# EAGLE design optoinout (EAGLE 9.4.0)

## Sheet 1 of 2
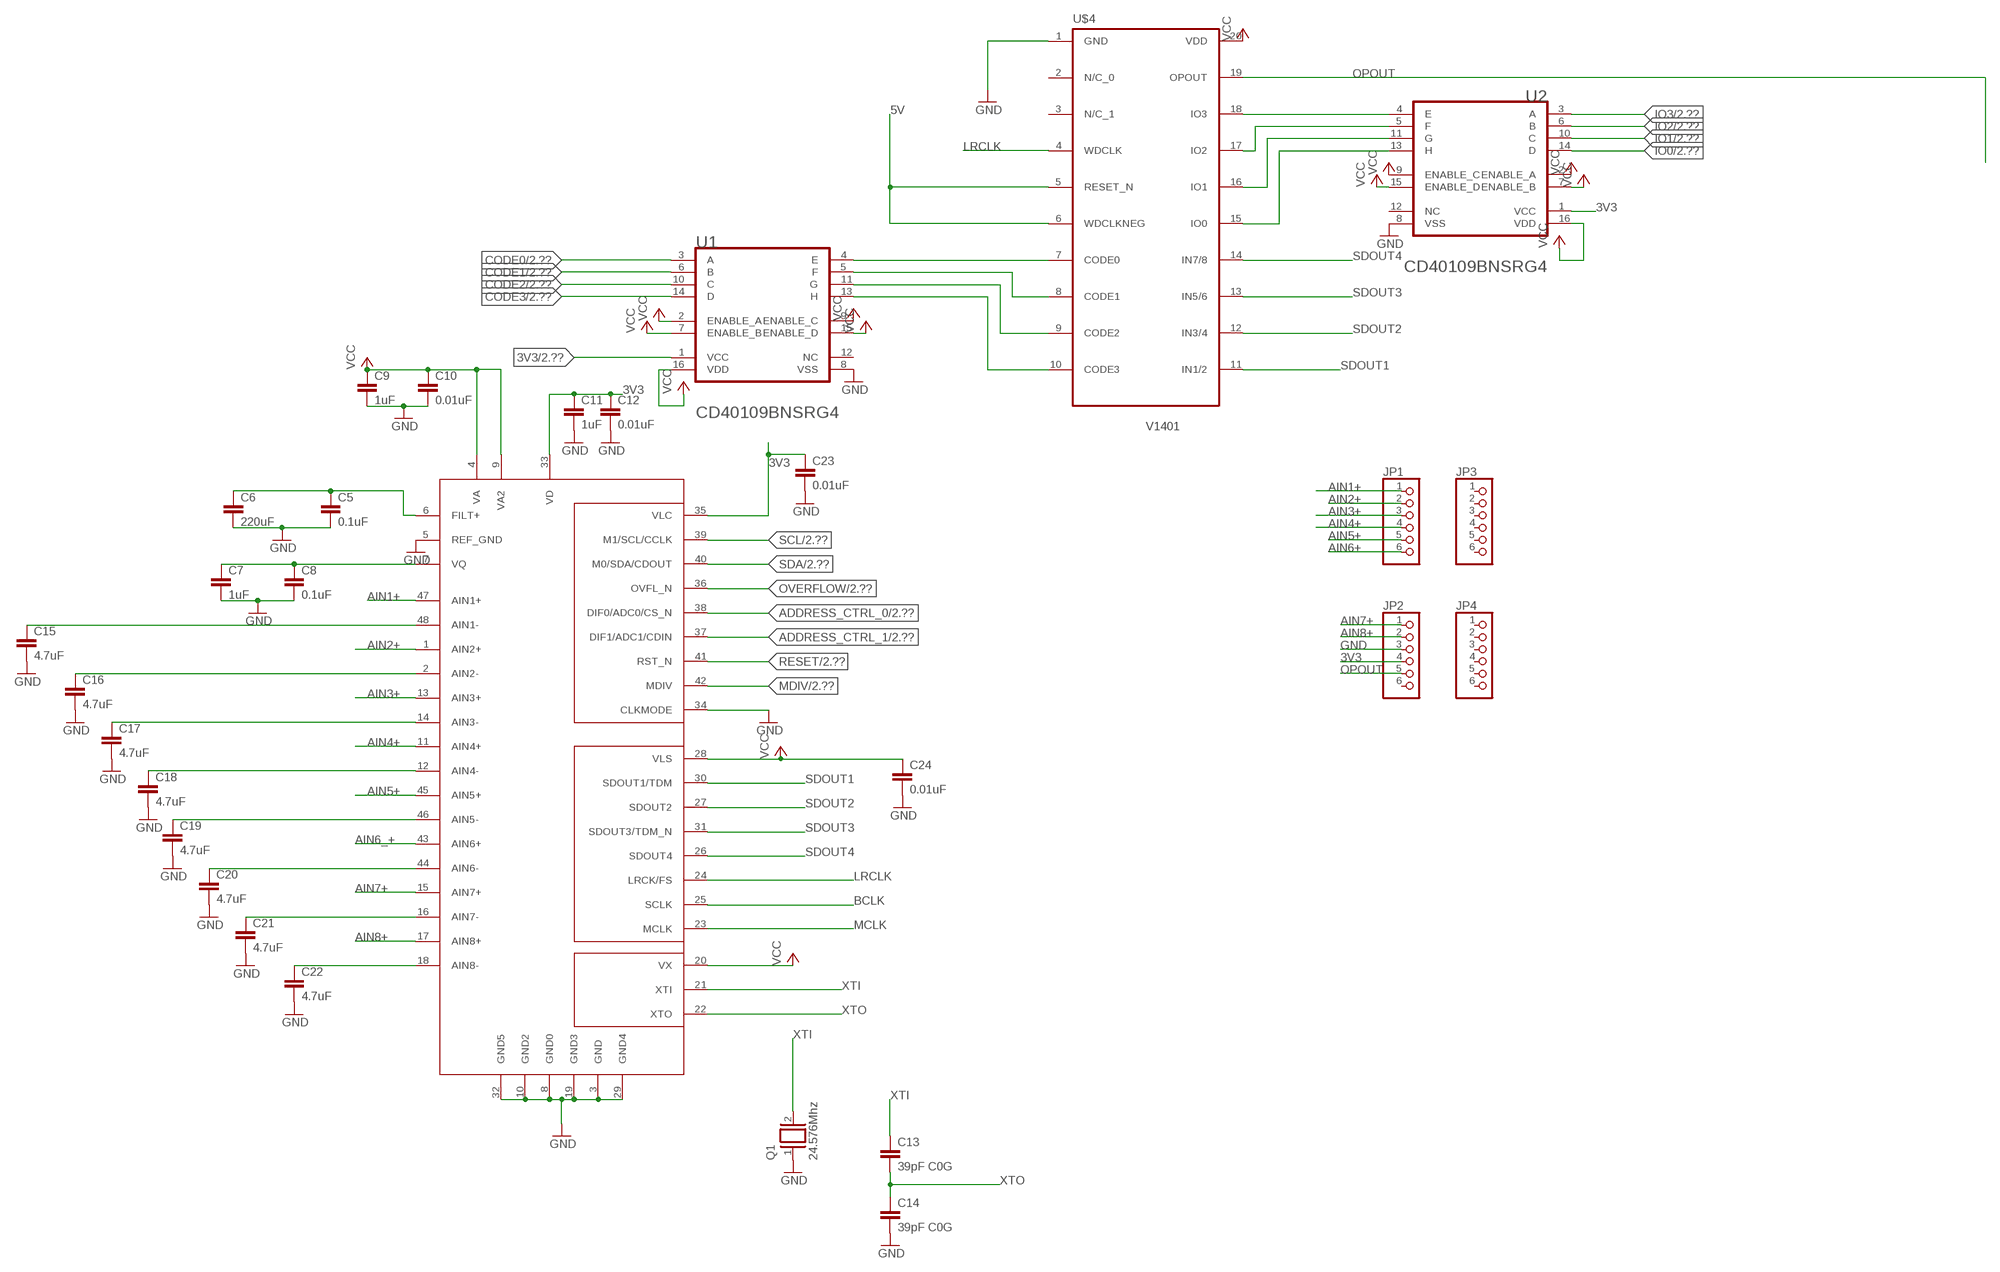
[diagram p0: schematic, sheet 1]

### Parts
C5  0.1uF  C-EUC1206  [C1206]
C6  220uF  C-EUC1206  [C1206]
C7  1uF  C-EUC1206  [C1206]
C8  0.1uF  C-EUC1206  [C1206]
C9  1uF  C-EUC1206  [C1206]
C10  0.01uF  C-EUC1206  [C1206]
C11  1uF  C-EUC1206  [C1206]
C12  0.01uF  C-EUC1206  [C1206]
C13  39pF C0G  C-EUC1206  [C1206]
C14  39pF C0G  C-EUC1206  [C1206]
C15  4.7uF  C-EUC1206  [C1206]
C16  4.7uF  C-EUC1206  [C1206]
C17  4.7uF  C-EUC1206  [C1206]
C18  4.7uF  C-EUC1206  [C1206]
C19  4.7uF  C-EUC1206  [C1206]
C20  4.7uF  C-EUC1206  [C1206]
C21  4.7uF  C-EUC1206  [C1206]
C22  4.7uF  C-EUC1206  [C1206]
C23  0.01uF  C-EUC1206  [C1206]
C24  0.01uF  C-EUC1206  [C1206]
JP1  PINHD-1X6  [1X06]
JP2  PINHD-1X6  [1X06]
JP3  PINHD-1X6  [1X06]
JP4  PINHD-1X6  [1X06]
Q1  24.576Mhz  XTAL/S  [QS]
U1  TEXAS_INSTRUMENTS_CD40109BNSRG4TEXAS_INSTRUMENTS_CD40109BNSRG4_0_0  [TEXAS_INSTRUMENTS_CD40109BNSRG4_0]
U2  TEXAS_INSTRUMENTS_CD40109BNSRG4TEXAS_INSTRUMENTS_CD40109BNSRG4_0_0  [TEXAS_INSTRUMENTS_CD40109BNSRG4_0]
U$3  CS5368-2  [QFP50P900X900X160-48N]
U$4  V1401  [SOP20]

### Nets
3V3: C11.1 C12.1 C23.1 JP2.4 U1.1(VCC) U2.1(VCC) U$3.33(VD) U$3.35(VLC) ; also sheet 2
5V: U$4.5(RESET_N) U$4.6(WDCLKNEG)
ADDRESS_CTRL_0: U$3.38(DIF0/ADC0/CS_N) ; also sheet 2
ADDRESS_CTRL_1: U$3.37(DIF1/ADC1/CDIN) ; also sheet 2
AIN1+: JP1.1 U$3.47(AIN1+)
AIN2+: JP1.2 U$3.1(AIN2+)
AIN3+: JP1.3 U$3.13(AIN3+)
AIN4+: JP1.4 U$3.11(AIN4+)
AIN5+: JP1.5 U$3.45(AIN5+)
AIN6+: JP1.6
AIN6_+: U$3.43(AIN6+)
AIN7+: JP2.1 U$3.15(AIN7+)
AIN8+: JP2.2 U$3.17(AIN8+)
BCLK: U$3.25(SCLK)
CODE0: U1.3(A) ; also sheet 2
CODE1: U1.6(B) ; also sheet 2
CODE2: U1.10(C) ; also sheet 2
CODE3: U1.14(D) ; also sheet 2
GND: C5.2 C6.2 C7.2 C8.2 C9.2 C10.2 C11.2 C12.2 C14.2 C15.2 C16.2 C17.2 C18.2 C19.2 C20.2 C21.2 C22.2 C23.2 C24.2 JP2.3 Q1.1 U1.8(VSS) U2.8(VSS) U$3.3(GND) U$3.5(REF_GND) U$3.8(GND0) U$3.10(GND2) U$3.19(GND3) U$3.29(GND4) U$3.32(GND5) U$3.34(CLKMODE) U$4.1(GND) ; also sheet 2
IO0: U2.14(D) ; also sheet 2
IO1: U2.10(C) ; also sheet 2
IO2: U2.6(B) ; also sheet 2
IO3: U2.3(A) ; also sheet 2
LRCLK: U$3.24(LRCK/FS) U$4.4(WDCLK)
MCLK: U$3.23(MCLK)
MDIV: U$3.42(MDIV) ; also sheet 2
N$2: C7.1 C8.1 U$3.7(VQ)
N$5: U1.4(E) U$4.7(CODE0)
N$6: C5.1 C6.1 U$3.6(FILT+)
N$7: U1.5(F) U$4.8(CODE1)
N$8: U1.11(G) U$4.9(CODE2)
N$9: U1.13(H) U$4.10(CODE3)
N$12: C16.1 U$3.2(AIN2-)
N$13: C15.1 U$3.48(AIN1-)
N$14: C17.1 U$3.14(AIN3-)
N$15: C18.1 U$3.12(AIN4-)
N$16: C19.1 U$3.46(AIN5-)
N$17: C20.1 U$3.44(AIN6-)
N$18: C21.1 U$3.16(AIN7-)
N$19: C22.1 U$3.18(AIN8-)
N$22: U2.4(E) U$4.18(IO3)
N$23: U2.5(F) U$4.17(IO2)
N$24: U2.11(G) U$4.16(IO1)
N$25: U2.13(H) U$4.15(IO0)
OPOUT: JP2.5 U$4.19(OPOUT)
OVERFLOW: U$3.36(OVFL_N) ; also sheet 2
RESET: U$3.41(RST_N) ; also sheet 2
SCL: U$3.39(M1/SCL/CCLK) ; also sheet 2
SDA: U$3.40(M0/SDA/CDOUT) ; also sheet 2
SDOUT1: U$3.30(SDOUT1/TDM) U$4.11(IN1/2)
SDOUT2: U$3.27(SDOUT2) U$4.12(IN3/4)
SDOUT3: U$3.31(SDOUT3/TDM_N) U$4.13(IN5/6)
SDOUT4: U$3.26(SDOUT4) U$4.14(IN7/8)
VCC: C9.1 C10.1 C24.1 U1.2(ENABLE_A) U1.7(ENABLE_B) U1.9(ENABLE_C) U1.15(ENABLE_D) U1.16(VDD) U2.2(ENABLE_A) U2.7(ENABLE_B) U2.9(ENABLE_C) U2.15(ENABLE_D) U2.16(VDD) U$3.4(VA) U$3.9(VA2) U$3.20(VX) U$3.28(VLS) U$4.20(VDD) ; also sheet 2
XTI: C13.1 Q1.2 U$3.21(XTI)
XTO: C13.2 C14.1 U$3.22(XTO)
Unconnected: JP2.6 JP3.1 JP3.2 JP3.3 JP3.4 JP3.5 JP3.6 JP4.1 JP4.2 JP4.3 JP4.4 JP4.5 JP4.6 U1.12(NC) U2.12(NC) U$4.2(N/C_0) U$4.3(N/C_1)

## Sheet 2 of 2
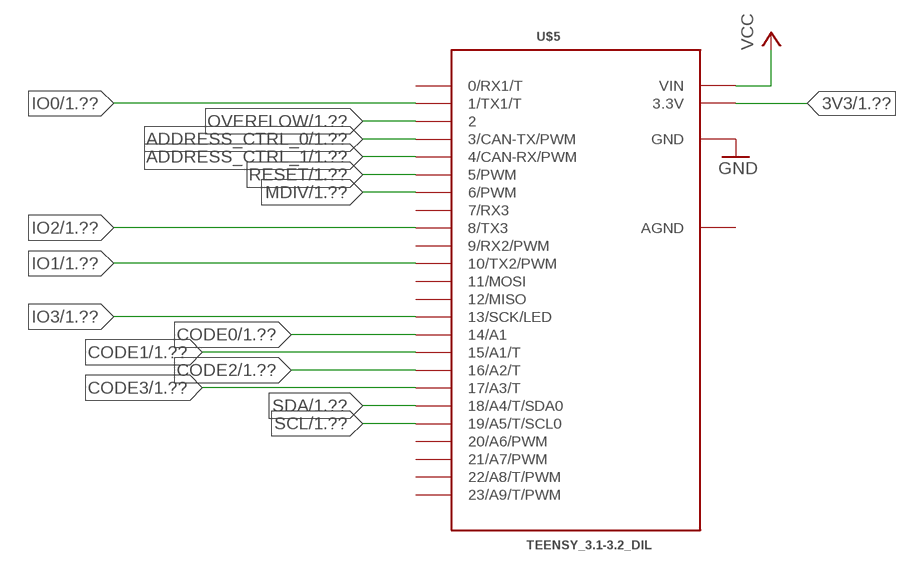
[diagram p1: schematic, sheet 2]

### Parts
U$5  TEENSY_3.1-3.2_DIL  [TEENSY_3.0-3.2&LC_DIL]

### Nets
3V3: U$5.3.3V ; also sheet 1
ADDRESS_CTRL_0: U$5.3(3/CAN-TX/PWM) ; also sheet 1
ADDRESS_CTRL_1: U$5.4(4/CAN-RX/PWM) ; also sheet 1
CODE0: U$5.14/A0(14/A1) ; also sheet 1
CODE1: U$5.15/A1(15/A1/T) ; also sheet 1
CODE2: U$5.16/A2(16/A2/T) ; also sheet 1
CODE3: U$5.17/A3(17/A3/T) ; also sheet 1
GND: U$5.GND ; also sheet 1
IO0: U$5.1(1/TX1/T) ; also sheet 1
IO1: U$5.10(10/TX2/PWM) ; also sheet 1
IO2: U$5.8(8/TX3) ; also sheet 1
IO3: U$5.13(13/SCK/LED) ; also sheet 1
MDIV: U$5.6(6/PWM) ; also sheet 1
OVERFLOW: U$5.2 ; also sheet 1
RESET: U$5.5(5/PWM) ; also sheet 1
SCL: U$5.19/A5(19/A5/T/SCL0) ; also sheet 1
SDA: U$5.18/A4(18/A4/T/SDA0) ; also sheet 1
VCC: U$5.VIN ; also sheet 1
Unconnected: U$5.0(0/RX1/T) U$5.7(7/RX3) U$5.9(9/RX2/PWM) U$5.11(11/MOSI) U$5.12(12/MISO) U$5.20/A6(20/A6/PWM) U$5.21/A7(21/A7/PWM) U$5.22/A8(22/A8/T/PWM) U$5.23/A9(23/A9/T/PWM)

## Power pins joined to a net without a drawn wire
AGND: U$5.AGND

## Library data of the parts
C5-C24 = resistor:C-EU: CAPACITOR, European symbol
JP1-JP4 = pinhead:PINHD-1X6: PIN HEADER
Q1 = special:XTAL/S: CRYSTAL
U1 U2 = Texas Instruments - CD40109BNSRG4:TEXAS_INSTRUMENTS_CD40109BNSRG4: TI-CD40109B-16; CIIVA_IDS: 1241581; COMPONENT_LINK_1_DESCRIPTION: Manufacturer URL; COMPONENT_LINK_1_URL: www.ti.com; COMPONENT_LINK_3_DESCRIPTION: Package Specification; COMPONENT_LINK_3_URL: http://www.ti.com/lit/ml/msop002a/msop002a.pdf; DATASHEET: http://www.ti.com/lit/ds/symlink/cd40109b.pdf; DATASHEET_VERSION: SCHS099B; FOOTPRINT_VARIANT_NAME_0: Level C; FOOTPRINT_VARIANT_NAME_1: Level B; FOOTPRINT_VARIANT_NAME_2: Level A; IMPORTED: yes; IMPORTED_FROM: vault; IMPORT_TS: 1521846607; MF: Texas Instruments; MOUNTING_TECHNOLOGY: Surface Mount; MPN: CD40109BNSRG4; NUMBER_OF_BITS: 4; NUMBER_OF_CHANNELS: 4; NUMBER_OF_OUTPUTS: 4; PACKAGE_DESCRIPTION: 16-Pin Plastic Small Outline Package, Body 10.2 x 5.3 mm, Pitch 1.27 mm; PACKAGE_VERSION: 4040062/C; PACKING: Tape and Reel; PREFIX: U; PROPAGATION_DELAY: 240 ns Max.; RELEASE_DATE: 1428502627; ROHS: Yes; TEMPERATURE_RANGE: -55 to 125 degC; VAULT_GUID: 5DE3101F-A9D4-473C-9841-2D565ABC94B0; VAULT_REVISION: 587A32E8-7AA7-4DF0-BE6A-FDFA12492D27; VSS: 3 to 18 V
U$3 = CS5368:CS5368-2
U$4 = coolaudio:V1401
U$5 = Teensy_3_and_LC_Series_Boards_v1.4:TEENSY_3.1-3.2_DIL: Teensy 3.1 or 3.2 in a DIL Layout.

## Module STIN
Ports: LEFT_OUT(io) RIGHT_OUT(io) AGND(io)
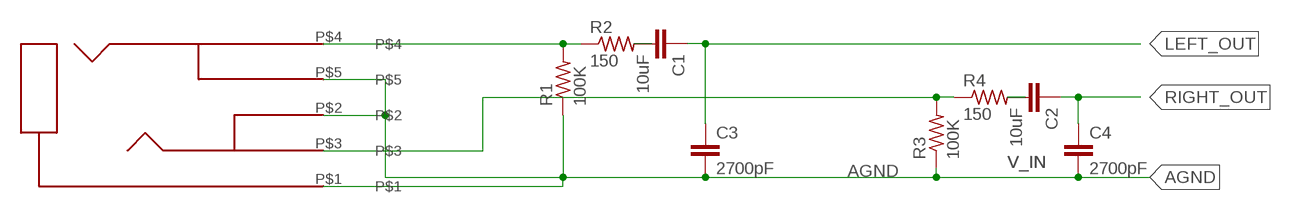
[diagram p2: schematic, module STIN, sheet 1]

### Parts
C1  10uF  C-EUC1206  [C1206]
C2  10uF  C-EUC1206  [C1206]
C3  2700pF  C-EUC1206  [C1206]
C4  2700pF  C-EUC1206  [C1206]
R1  100K  R-US_R1206  [R1206]
R2  150  R-US_R1206  [R1206]
R3  100K  R-US_R1206  [R1206]
R4  150  R-US_R1206  [R1206]
U$3  ACJS-MV-5  [ACJS-MV5]

### Nets
AGND: C3.2 C4.2 R1.1 R3.1 U$3.P$1 U$3.P$2 U$3.P$5
LEFT_OUT [defaultyyyy]: C1.1 C3.1
N$1 [defaultyyyy]: R1.2 R2.1 U$3.P$4
N$7 [defaultyyyy]: C1.2 R2.2
N$10 [defaultyyyy]: R3.2 R4.1 U$3.P$3
N$11 [defaultyyyy]: C2.2 R4.2
RIGHT_OUT [defaultyyyy]: C2.1 C4.1

### Library data of the parts
C1-C4 = resistor-nick:C-EU: CAPACITOR, European symbol
R1-R4 = resistor-nick:R-US_: RESISTOR, American symbol
U$3 = acjs-mv:ACJS-MV-5

## Board
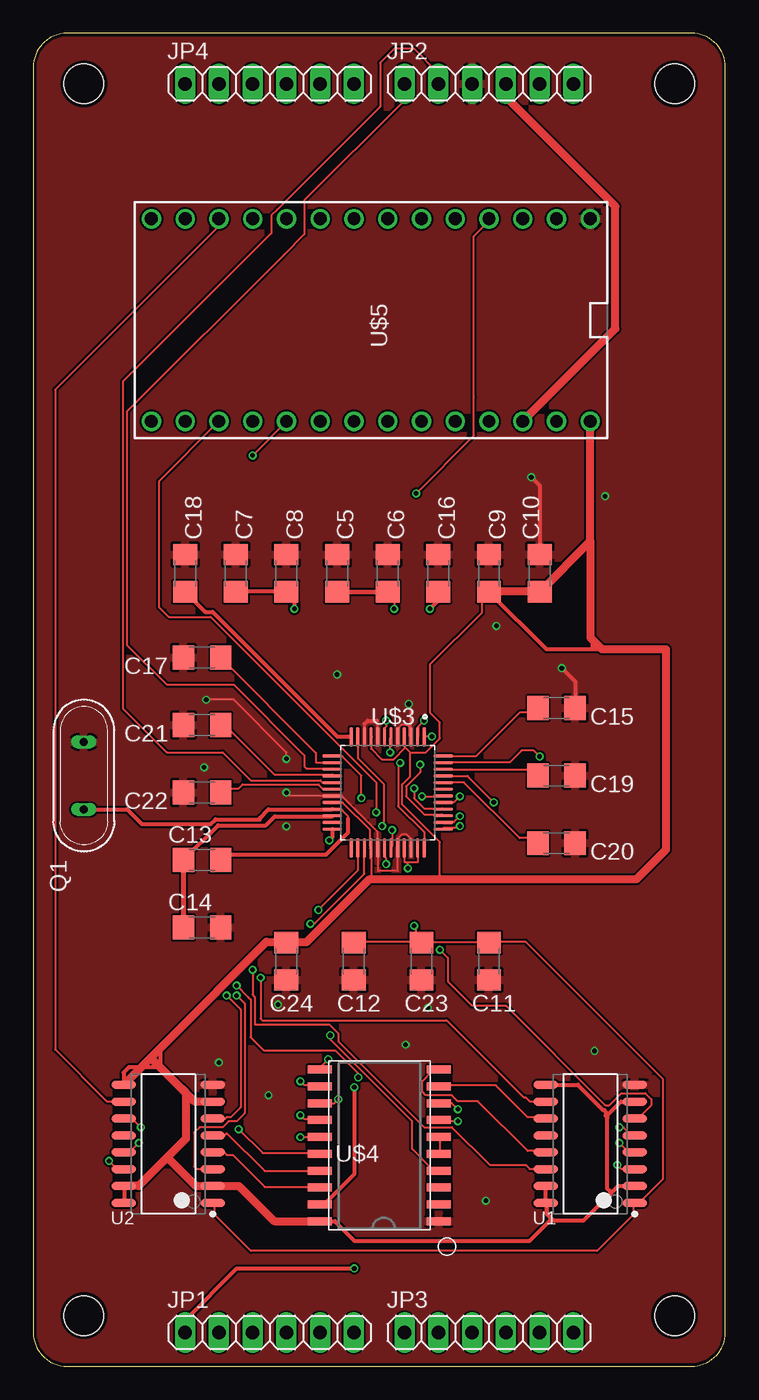
[diagram p3: board, top side]
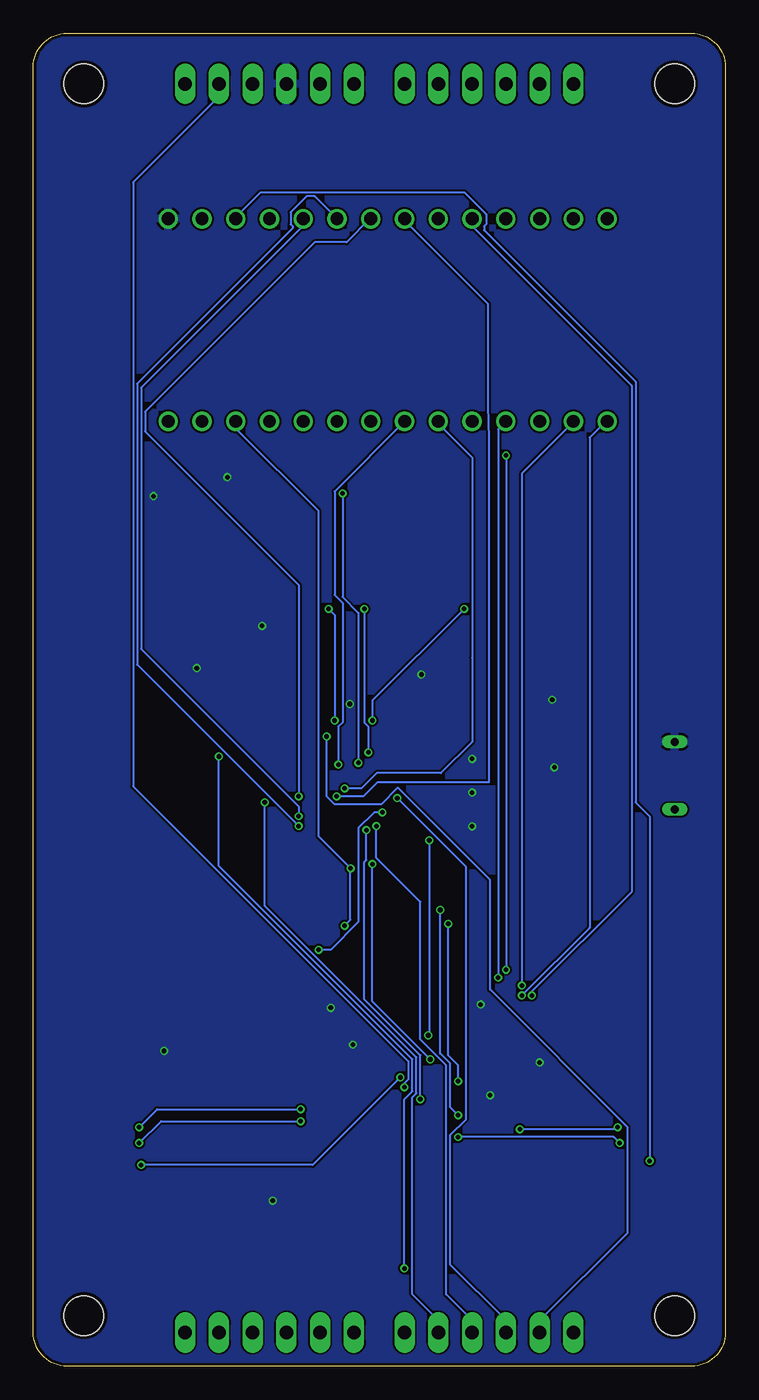
[diagram p4: board, bottom side, seen from below]

Size 52.07 x 100.33 mm. Coordinates in mm from the lower left corner, seen from the top.
Outline: 2.54,0 49.53,0 arc90 52.07,2.54 52.07,97.79 arc90 49.53,100.33 2.54,100.33 arc90 0,97.79 0,2.54 arc90 2.54,0
Copper layers (1*16): Top 0.018mm / dielectric 1.55mm / Bottom 0.018mm
Design rules "eC_2Layer_PClass6_BaseCopperO18_eCDefault": minimum track width 0.15mm, minimum drill 0.35mm, track to track 0.15mm, track to pad 0.15mm, pad to pad 0.15mm, via to via 0.15mm, smd to smd 0mil, copper to edge 0.25mm, drill to drill 0.35mm, minimum pad ring 0.175mm, minimum via ring 0.125mm, stop-mask expansion 0mil, vias tented up to drill 0.45mm, thermal gap 0.2mm
Holes 3 mm at 3.81,96.52 48.26,96.52 3.81,3.81 48.26,3.81

### Footprints (pad centres in the part's own frame; a part is rotated, then mirrored left to right if it is on the bottom)
C1206 = smd 1.6 x 1.8: 1 -1.4,0; 2 1.4,0
1X06 = drill 1.016 long: 1 -6.35,0; 2 -3.81,0; 3 -1.27,0; 4 1.27,0; 5 3.81,0; 6 6.35,0
QS = drill 0.61 long: 1 -2.54,0; 2 2.54,0
TEXAS_INSTRUMENTS_CD40109BNSRG4_0 = smd 1.85 x 0.6: 1 -3.35,4.445; 2 -3.35,3.175; 3 -3.35,1.905; 4 -3.35,0.635; 5 -3.35,-0.635; 6 -3.35,-1.905; 7 -3.35,-3.175; 8 -3.35,-4.445; 9 3.35,-4.445; 10 3.35,-3.175; 11 3.35,-1.905; 12 3.35,-0.635; 13 3.35,0.635; 14 3.35,1.905; 15 3.35,3.175; 16 3.35,4.445
QFP50P900X900X160-48N = smd 1.49 x 0.26: 1 -4.17,2.75; 2 -4.17,2.25; 3 -4.17,1.75; 4 -4.17,1.25; 5 -4.17,0.75; 6 -4.17,0.25; 7 -4.17,-0.25; 8 -4.17,-0.75; 9 -4.17,-1.25; 10 -4.17,-1.75; 11 -4.17,-2.25; 12 -4.17,-2.75; 25 4.17,-2.75; 26 4.17,-2.25; 27 4.17,-1.75; 28 4.17,-1.25; 29 4.17,-0.75; 30 4.17,-0.25; 31 4.17,0.25; 32 4.17,0.75; 33 4.17,1.25; 34 4.17,1.75; 35 4.17,2.25; 36 4.17,2.75 | smd 0.26 x 1.49: 13 -2.75,-4.17; 14 -2.25,-4.17; 15 -1.75,-4.17; 16 -1.25,-4.17; 17 -0.75,-4.17; 18 -0.25,-4.17; 19 0.25,-4.17; 20 0.75,-4.17; 21 1.25,-4.17; 22 1.75,-4.17; 23 2.25,-4.17; 24 2.75,-4.17; 37 2.75,4.17; 38 2.25,4.17; 39 1.75,4.17; 40 1.25,4.17; 41 0.75,4.17; 42 0.25,4.17; 43 -0.25,4.17; 44 -0.75,4.17; 45 -1.25,4.17; 46 -1.75,4.17; 47 -2.25,4.17; 48 -2.75,4.17
SOP20 = smd 0.6 x 1.8: 1 -5.715,-4.475; 2 -4.445,-4.475; 3 -3.175,-4.475; 4 -1.905,-4.475; 5 -0.635,-4.475; 6 0.635,-4.475; 7 1.905,-4.475; 8 3.175,-4.475; 9 4.445,-4.475; 10 5.715,-4.475; 11 5.715,4.5; 12 4.445,4.5; 13 3.175,4.5; 14 1.905,4.5; 15 0.635,4.5; 16 -0.635,4.5; 17 -1.905,4.5; 18 -3.175,4.5; 19 -4.445,4.5; 20 -5.715,4.5
TEENSY_3.0-3.2&LC_DIL = drill 0.965: 0 -7.62,13.97; 1 -7.62,11.43; 2 -7.62,8.89; 3 -7.62,6.35; 3.3V 7.62,11.43; 4 -7.62,3.81; 5 -7.62,1.27; 6 -7.62,-1.27; 7 -7.62,-3.81; 8 -7.62,-6.35; 9 -7.62,-8.89; 10 -7.62,-11.43; 11 -7.62,-13.97; 12 -7.62,-16.51; 13 7.62,-16.51; 14/A0 7.62,-13.97; 15/A1 7.62,-11.43; 16/A2 7.62,-8.89; 17/A3 7.62,-6.35; 18/A4 7.62,-3.81; 19/A5 7.62,-1.27; 20/A6 7.62,1.27; 21/A7 7.62,3.81; 22/A8 7.62,6.35; 23/A9 7.62,8.89; AGND 7.62,13.97; GND -7.62,16.51; VIN 7.62,16.51

### Placement (x,y rotation side)
C5  22.86,59.69 90 top
C6  26.67,59.69 90 top
C7  15.24,59.69 90 top
C8  19.05,59.69 90 top
C9  34.29,59.69 90 top
C10  38.1,59.69 90 top
C11  34.29,30.48 270 top
C12  24.13,30.48 270 top
C13  12.7,38.1 180 top
C14  12.7,33.02 0 top
C15  39.37,49.53 0 top
C16  30.48,59.69 90 top
C17  12.7,53.34 180 top
C18  11.43,59.69 90 top
C19  39.37,44.45 0 top
C20  39.37,39.37 0 top
C21  12.7,48.26 180 top
C22  12.7,43.18 180 top
C23  29.21,30.48 270 top
C24  19.05,30.48 270 top
JP1  17.78,2.54 0 top
JP2  34.29,96.52 0 top
JP3  34.29,2.54 0 top
JP4  17.78,96.52 0 top
Q1  3.81,44.45 270 top
U1  41.91,16.74 180 top
U2  10.16,16.74 180 top
U$3  26.67,43.18 270 top
U$4  26.05,16.63 90 top
U$5  25.4,78.74 270 top

### Tracks (layer width: path | path; a pad name or v marks a point on that pad's centre or on a via)
3V3  (via drill 0.35)
  Top 0.15: 27.9,39 U$3.33 | 28.95,39 U$3.35 | 28.8,31.95 29.1,31.95 C23.1 | 28.8,31.95 24.15,31.95 C12.1 | C23.1 29.25,31.95 34.2,31.95 C11.1 34.35,31.95 37.05,31.95 47.4,21.6 47.4,14.1 45.6,12.3 45.3,12.3 U1.1 45.15,12.15 45.15,11.4 42.42,8.67 16.38,8.67 13.65,11.4 13.65,12.15 U2.1 | v28.65,33.15 28.8,33 28.8,31.95 | 28.8,31.95 C23.1
  Top 0.152: U$3.33 27.92,37.94 28.19,37.94 | 28.95,39 28.95,37.94 28.19,37.94 | v28.19,37.48 28.19,37.94
  Top 0.61: U$5.3.3V 43.8,78.09 43.8,87.3 35.56,95.54 JP2.4
  Bottom 0.15: v28.65,33.15 28.2,33.6 v28.2,37.48 v28.19,37.48 30.6,39.89 30.6,64.35 36.75,70.5 36.75,71.1 U$5.3.3V
5V
  Top 0.15: U$4.5 30.6,16.05 30.6,17.25 U$4.6
ADDRESS_CTRL_0  (via drill 0.35)
  Top 0.15: v32.1,41.4 31.65,40.95 30.9,40.95 U$3.38
  Bottom 0.15: v32.1,41.4 32.1,42.15 43.95,54 43.95,73.65 31.8,85.8 31.8,86.25 U$5.3
ADDRESS_CTRL_1  (via drill 0.35)
  Top 0.15: v32.1,40.65 31.95,40.5 30.9,40.5 U$3.37
  Bottom 0.15: v32.1,40.65 44.25,52.8 44.25,73.95 32.55,85.65 32.55,85.8 32.7,85.95 32.7,86.85 31.5,88.05 30.9,88.05 U$5.4
AIN1+  (via drill 0.35)
  Top 0.15: v38.1,45.9 37.65,46.35 36.75,46.35 35.85,45.45 30.9,45.45 U$3.47
  Top 0.305: JP1.1 11.43,3.47 15.32,7.36 v24.15,7.36
  Bottom 0.15: v38.1,45.9 38.1,37.65 23.55,23.1 23.55,20.7 24.15,20.1 v24.15,7.36
AIN2+  (via drill 0.35)
  Top 0.15: v30,47.4 29.4,47.4 U$3.1
  Bottom 0.15: v30,47.4 30,42.9 29.4,42.3 25.9,42.3 24.65,43.55 17.7,36.6 17.7,28.35 7.35,18 7.35,10.05 13.95,3.45 13.95,2.55 JP1.2
AIN3+  (via drill 0.35)
  Top 0.15: v24.69,42.76 24.69,44.46 23.25,45.9 22.5,45.9 U$3.13
  Bottom 0.15: v24.69,42.76 19.5,37.57 19.5,18.6 20.7,17.4 20.7,7.65 16.65,3.6 16.65,2.55 JP1.3
AIN4+  (via drill 0.35)
  Top 0.15: v26.25,40.65 26.4,40.8 26.4,43.8 24.45,45.75 24.45,47.25 U$3.11
  Bottom 0.15: v26.25,40.65 26.25,38.25 22.95,34.95 22.95,24.6 21,22.65 21,5.4 19.05,3.45 JP1.4
AIN5+  (via drill 0.35)
  Top 0.152: U$3.45 32.67,44.43 v34.65,42.45
  Bottom 0.15: v34.65,42.45 34.65,34.65 23.25,23.25 23.25,20.55 23.55,20.25 23.55,5.4 21.6,3.45 JP1.5
AIN7+
  Top 0.15: 20.39,45.16 20.55,45 22.5,45 U$3.15 | 14.25,51.3 10.05,51.3 7.05,54.3 7.05,71.85 18.88,83.68 | 20.4,87.71 20.4,87.75 27.9,95.25 27.9,96.45 JP2.1
  Top 0.152: 14.25,51.3 15.08,51.3 20.39,45.99 20.39,45.16 | 20.4,87.71 20.4,85.2 18.88,83.68
AIN8+
  Top 0.15: 17.92,85.27 6.75,74.1 6.75,49.5 10.05,46.2 14.25,46.2 16.35,44.1 21.6,44.1 21.75,43.95 22.5,43.95 U$3.17 | 18.36,87.06 26.1,94.8 26.1,98.1 27.15,99.15 28.65,99.15 30.45,97.35 30.45,96.6 JP2.2
  Top 0.152: 18.36,87.06 17.92,86.62 17.92,85.27
CODE0  (via drill 0.35)
  Top 0.15: v43.95,15.15 44.25,14.85 45.15,14.85 U1.3 | v24.45,21.75 24.45,22.05 22.73,23.77 | v15.3,28.65 16.18,27.77
  Top 0.152: 16.18,27.77 16.35,27.6 16.35,24.77 17.35,23.77 22.73,23.77
  Bottom 0.15: v43.95,15.15 31.05,15.15 v24.45,21.75 | v15.3,28.65 15.3,67.2 11.4,71.1 U$5.14/A0
CODE1  (via drill 0.35)
  Top 0.15: v30.6,31.35 31.2,30.75 31.2,28.95 33,27.15 35.55,27.15 43.05,19.65 43.35,19.65 44.25,20.55 46.05,20.55 46.5,20.1 46.5,19.65 45.6,18.75 45.3,18.75 U1.6 | v25.8,41.7 25.8,43.95 13.35,56.4 10.2,56.4 9.45,57.15 9.45,66.6 U$5.15/A1
  Bottom 0.15: v30.6,31.35 29.7,31.35 27.6,33.45 27.6,40.5 26.4,41.7 v25.8,41.7
CODE2  (via drill 0.35)
  Top 0.15: v17.1,29.25 17.1,26.16 17.22,26.04 31.11,26.04 36.9,20.25 37.05,20.25 37.35,19.95 38.55,19.95 U1.10
  Bottom 0.15: v17.1,29.25 17.1,70.51 16.51,71.1 U$5.16/A2
CODE3  (via drill 0.35)
  Top 0.15: 22.49,25.51 22.95,25.05 22.95,24.45 29.4,18 31.5,18 34.35,15.15 37.05,15.15 37.35,14.85 38.55,14.85 U1.14 | 16.68,27.8 16.5,27.98 v16.5,29.85 | v16.5,68.55 19.05,71.1 U$5.17/A3
  Top 0.152: 16.68,27.8 16.68,25.72 22.28,25.72 22.49,25.51
  Bottom 0.15: v16.5,68.55 v16.5,29.85
GND  (via drill 0.35)
  Top 0.15: 25.95,39 U$3.29 25.88,39.06 25.88,40.27 23.25,42.9 22.5,42.9 U$3.19 | 27.45,39 U$3.32 27.45,39.15 27.45,39.75 27.75,40.05 28.05,40.05 28.35,39.75 28.35,39.15 U$3.34 | U$3.10 24.9,47.4 24.9,48.15 24.92,48.33 | 25.95,47.4 U$3.8
  Top 0.152: U$3.19 19.3,42.93 v19.05,43.18 | U$3.10 24.92,46.69 | 25.95,46.72 25.95,47.4 | v28.26,49.85 28.42,49.69 U$3.3 28.28,47.49 28.28,48.15 28.11,48.32 27.73,48.32 27.42,48.01 U$3.5 27.42,47.37 27.45,47.4 | U$3.8 25.92,48.53 25.88,48.58 | 25.95,39 25.95,37.27 27.43,37.27 27.43,38.92 27.45,39 | v13.02,50.16 13.03,50.18 15.07,50.18 19.05,46.2 v19.05,45.72
  Top 0.305: v37.47,66.91 38.1,66.28 C10.2 | v39.77,52.55 40.77,51.54 C15.2 | 24.92,48.33 25.17,48.58 25.88,48.58
  other vias: 13.97,22.86 22.86,52.07 19.05,40.64 12.86,45.09 18.41,27.23 42.23,23.73 34.05,12.46 43.02,65.48 34.85,55.72 17.7,20.4 28.02,24.21 29.69,26.99
  pour Top: -1.27,101.6 53.34,101.6 53.34,-1.27 -1.27,-1.27
  pour Bottom: 0,100.33 52.07,100.33 52.07,0 0,0
IO0  (via drill 0.35)
  Top 0.15: v5.7,15.45 6.3,14.85 6.75,14.85 U2.14
  Bottom 0.15: v5.7,15.45 5.7,41.4 6.75,42.45 6.75,74.1 18.15,85.5 18.15,85.8 18,85.95 18,86.7 19.65,88.35 34.95,88.35 36.9,86.4 U$5.1
IO1
  Top 0.15: U2.10 6.75,19.95 5.55,19.95 1.65,23.85 1.65,73.5 13.95,85.8 13.95,86.25 U$5.10
IO2  (via drill 0.35)
  Top 0.15: v14.55,27.9 15.6,26.85 15.6,19.5 14.85,18.75 14.55,18.75 14.4,18.6 13.65,18.6 U2.6
  Bottom 0.15: v14.55,27.9 14.55,28.2 7.05,35.7 7.05,73.8 19.05,85.8 U$5.8
IO3  (via drill 0.35)
  Top 0.15: v15.3,27.9 15.9,27.3 15.9,19.05 15.3,18.45 14.7,18.45 14.25,18 12.51,18 12.11,17.59 12.11,15.04 12.3,14.85 13.5,14.85 U2.3
  Bottom 0.15: v15.3,27.9 10.2,33 10.2,69.9 9,71.1 U$5.13
LRCLK  (via drill 0.35)
  Top 0.15: v22.35,24.9 22.35,24.6 28.5,18.45 28.5,16.35 30,14.85 30.45,14.85 U$4.4
  Top 0.305: v22.27,39.59 22.5,39.82 U$3.24
  Bottom 0.15: v22.27,39.59 22.27,24.98 v22.35,24.9
MDIV  (via drill 0.35)
  Top 0.15: v29.25,42.9 30.75,42.9 U$3.42
  Bottom 0.15: v29.25,42.9 27.23,42.9 26.18,43.95 | 17.85,72.3 17.85,79.95 24.15,86.25 U$5.6
  Bottom 0.152: 26.18,43.95 17.77,43.95 17.77,69.82 17.85,72.3
N$2  (via drill 0.35)
  Top 0.15: v26.55,48.6 26.55,48.15 26.4,48 26.4,47.4 U$3.7 | 19.05,58.34 C8.1
  Top 0.305: C7.1 15.29,58.34 19.05,58.34 | C8.1 19.65,57.69 v19.65,57
  Bottom 0.15: v26.55,48.6 26.55,50.1 v19.65,57
N$5  (via drill 0.35)
  Top 0.15: v31.95,18.45 30.6,18.45 U$4.7 | v44.1,16.8 44.7,16.2 45.15,16.2 U1.4
  Bottom 0.15: v31.95,18.45 42.45,18.45 v44.1,16.8
N$6  (via drill 0.35)
  Top 0.15: v26.85,46.21 26.85,47.25 U$3.6 | v27.15,57 27.15,57.75 26.7,58.2 C6.1 26.55,58.35 22.95,58.35 C5.1
  Top 0.305: C5.1 C6.1
  Bottom 0.15: v26.85,46.21 26.85,48.15 27.15,48.45 v27.15,57
N$7  (via drill 0.35)
  Top 0.15: v31.95,19.35 31.5,19.8 30.6,19.8 U$4.8 | v44.1,18 44.4,18 45.15,17.25 U1.5
  Bottom 0.15: v31.95,19.35 42.75,19.35 v44.1,18
N$8
  Top 0.15: U$4.9 30.6,21.15 34.8,21.15 37.2,18.75 38.55,18.75 U1.11
N$9
  Top 0.15: U$4.10 30.45,22.2 30,22.2 29.25,21.45 29.25,20.7 29.55,20.4 31.5,20.4 31.95,19.95 33.45,19.95 37.2,16.2 38.55,16.2 U1.13
N$12  (via drill 0.35)
  Top 0.15: v29.4,48.6 28.95,48.15 28.95,47.4 U$3.2
  Top 0.305: C16.1 30.48,57.63 v29.85,57
  Bottom 0.15: v29.4,48.6 29.4,56.55 v29.85,57
N$13
  Top 0.15: U$3.48 30.9,45.9 33.3,45.9 36.6,49.2 37.65,49.2 37.95,49.5 C15.1
N$14
  Top 0.15: 21.27,45.45 22.5,45.45 U$3.14
  Top 0.152: C17.1 21.27,46.17 21.27,45.45
N$15
  Top 0.15: 23.86,47.39 U$3.12
  Top 0.305: C18.1 12.94,56.78 13.51,56.78 22.89,47.39 23.86,47.39
N$16
  Top 0.15: 37.6,44.9 37.95,44.55 C19.1
  Top 0.152: U$3.46 37.57,44.93 37.6,44.9
N$17
  Top 0.15: U$3.44 30.9,43.95 32.4,43.95 36.6,39.75 37.65,39.75 37.95,39.45 C20.1
N$18
  Top 0.15: U$3.16 22.5,44.55 18.11,44.55 14.81,47.85 14.4,47.85 14.1,48.15 C21.1
N$19
  Top 0.15: U$3.18 22.5,43.5 21.75,43.5 21.45,43.8 15.75,43.8 15.45,43.5 14.4,43.5 14.1,43.2 C22.1
N$22
  Top 0.15: U$4.18 21.45,13.5 17.4,13.5 15,15.9 14.55,15.9 14.4,16.05 13.65,16.05 U2.4
N$23
  Top 0.15: U$4.17 21.45,14.7 17.4,14.7 14.55,17.55 14.4,17.4 13.65,17.4 U2.5
N$24  (via drill 0.35)
  Top 0.15: v15.45,17.85 17.25,16.05 21.45,16.05 U$4.16 | v8.1,18 7.5,18.6 6.9,18.6 U2.11
  Bottom 0.15: v15.45,17.85 8.25,17.85 v8.1,18
N$25  (via drill 0.35)
  Top 0.15: v20.1,17.25 21.45,17.25 U$4.15 | v7.95,16.8 7.35,16.2 6.9,16.2 U2.13
  Bottom 0.15: v20.1,17.25 8.4,17.25 v7.95,16.8
OPOUT  (via drill 0.35)
  Top 0.15: 21.75,12.3 21.6,12.3 U$4.19
  Top 0.305: 21.75,12.3 22.02,12.3 24.15,14.43 v24.15,21
  Bottom 0.15: v24.15,21 24.15,21.3 23.85,21.6 23.85,22.95 44.55,43.65 44.55,89.1 38.1,95.55 JP2.5
OVERFLOW  (via drill 0.35)
  Top 0.15: v27.6,45.41 27.45,45.27 27.45,42.15 29.4,40.2 29.4,39.15 U$3.36 | v28.8,65.7 33,69.9 | 33.15,72.95 33.15,85.05 34.35,86.25 U$5.2
  Top 0.152: 33,69.9 33.15,70.05 33.15,72.95
  Bottom 0.15: v27.6,45.41 27.6,56.7 28.8,57.9 v28.8,65.7
RESET  (via drill 0.35)
  Top 0.15: v32.1,42.9 31.65,42.45 30.9,42.45 U$3.41
  Bottom 0.15: v32.1,42.9 32.1,58.8 43.65,70.35 43.65,71.85 30.9,84.6 28.5,84.6 26.7,86.4 U$5.5
SCL  (via drill 0.35)
  Top 0.15: v29.11,45.28 29.11,44.71 28.05,43.65 28.05,42.9 29.4,41.55 30.75,41.55 U$3.39
  Bottom 0.15: v29.11,45.28 29.11,48.14 28.8,48.45 28.8,57.45 29.4,58.05 29.4,65.85 U$5.19/A5
SDA  (via drill 0.35)
  Top 0.15: v28.65,43.5 28.65,42.75 29.4,42 30.75,42 U$3.40
  Bottom 0.15: v28.65,43.5 27.38,43.5 26.23,44.65 | 19.05,53.34 19.05,68.4 21.61,70.96 21.61,71.1 U$5.18/A4
  Bottom 0.152: 19.05,53.34 19.05,46.99 21.39,44.65 26.23,44.65
SDOUT1  (via drill 0.35)
  Top 0.15: v26.55,37.8 26.55,38.25 26.4,38.4 26.4,39 U$3.30 | v22.2,23.1 21.45,22.35 U$4.11
  Bottom 0.15: v26.55,37.8 26.55,27.45 v22.2,23.1
SDOUT2  (via drill 0.35)
  Top 0.15: 24.75,36.9 21.15,33.3 v20.85,33.3 | v20.1,21.45 20.4,21.15 21.45,21.15 U$4.12 | 24.9,39 U$3.27
  Top 0.152: 24.75,36.9 24.92,37.07 U$3.27
  Bottom 0.15: v20.85,33.3 20.85,23.4 20.1,22.65 v20.1,21.45
SDOUT3  (via drill 0.35)
  Top 0.15: v27,40.35 27,39.15 U$3.31 | v22.95,20.1 22.65,19.8 21.6,19.8 U$4.13
  Bottom 0.15: v27,40.35 27,38.1 27.15,37.95 27.15,27.6 22.95,23.4 v22.95,20.1
SDOUT4  (via drill 0.35)
  Top 0.15: v21.45,34.35 24.45,37.35 24.45,39 U$3.26 | v20.1,18.9 20.4,18.6 21.45,18.6 U$4.14
  Bottom 0.15: v21.45,34.35 21.45,23.55 20.7,22.8 20.7,19.5 v20.1,18.9
VCC
  Top 0.15: 28.35,46.2 29.55,46.2 30.6,47.25 30.6,48.45 29.85,49.2 29.85,52.8 33.75,56.7 33.75,57.75 C9.1 34.35,58.35 38.1,58.35 C10.1 | 28.35,46.2 27.99,46.56 27.9,46.65 27.9,47.25 U$3.4 | 25.5,47.4 U$3.9 | 41.85,71.1 U$5.VIN | U$3.20 22.5,42.45 23.25,42.45 25.35,40.35 25.35,39.15 U$3.28 25.35,39 25.35,38.25 | 19.05,31.95 C24.1 19.05,31.8 18.57,31.8 | 43.5,13.05 41.42,10.97 41.4,10.95 39.15,10.95 39.06,11.04 39,11.1 38.7,11.4 38.7,12.15 38.64,12.21 U1.16 | 43.5,13.05 43.95,13.5 45.15,13.5 U1.2 | 43.2,18.89 43.2,19.05 43.07,19.18 | 43.5,13.05 43.4,13.15 | 45.15,19.95 U1.7 | 20.8,10.95 21.45,10.95 U$4.20 | 6.9,13.5 U2.15 6.9,13.65 | 7.2,22.5 9.6,22.5 9.6,22.54 | 11.72,20.38 12.15,19.95 13.5,19.95 U2.7 | 10.05,15.6 10.2,15.6 12.15,13.65 13.5,13.65 U2.2 | 28.35,46.2 28.35,44.4 27.75,43.8 27.75,42.3 30.6,39.45
  Top 0.152: U$3.9 25.42,46.49 26.23,45.68 27.11,45.68 27.99,46.56 | 30.6,39.45 30.6,36.95 30.32,36.67 25.32,36.67 25.42,36.77 U$3.28 | 44.1,19.79 44.22,19.91
  Top 0.305: U2.16 6.9,12.38 6.9,13.5 | 8.14,13.77 10.08,15.71 11.51,17.14 | U2.7 12.19,19.91 11.72,20.38 11.21,20.89 9.6,22.5 | U2.9 6.81,22.11 7.2,22.5 9.56,22.5 9.6,22.54 9.6,23.8 17.6,31.8 18.57,31.8 | 12.23,13.56 U2.2 13.65,13.56 15.48,13.56 | U$4.20 21.75,10.91 22.69,10.91 24.15,9.45 37.35,9.45 39,11.1 39.13,10.97 41.42,10.97 43.95,13.5 44.01,13.56 U1.2 | 39.06,11.04 38.64,11.46 38.64,12.21 | U1.16 U1.15 | 43.4,13.15 43.2,13.35 43.2,18.73 | 43.2,18.73 43.2,18.89 44.1,19.79 | 44.22,19.91 U1.7 | U1.9 40.98,21.18 42.89,19.27 42.98,19.27 43.07,19.18 43.07,18.86 43.2,18.73 | 42.07,53.98 38.6,53.98 C9.1 C10.1 38.16,58.35 41.91,62.1 42.07,61.94 42.07,53.98 | 42.07,53.98 42.78,53.98 | 47.62,53.9 47.62,53.98 | 19.37,31.95 19.05,31.95
  Top 0.61: C9.1 34.35,58.35 38.16,58.35 | C10.1 41.91,62.1 | 41.91,62.1 U$5.VIN | C24.1 19.08,31.91 20.56,31.91 25.32,36.67 45.4,36.67 47.62,38.89 47.62,53.9 | 41.91,62.1 41.91,54.85 42.78,53.98 47.62,53.98 | U2.9 8.85,23.22 | 8.85,23.22 13.79,28.17 13.79,28.21 17.53,31.95 19.37,31.95 | U2.7 12.15,19.91 8.85,23.22 | 11.21,20.89 11.51,20.59 11.51,17.14 8.14,13.77 7.93,13.56 U2.15 | 10.08,15.71 12.23,13.56 13.65,13.56 | U2.2 15.48,13.56 18.13,10.91 21.75,10.91
XTI
  Top 0.15: 23.7,41.2 23.7,41.4 23.25,41.85 22.5,41.85 U$3.21 | 3.9,41.85 Q1.2
  Top 0.305: U$3.21 22.48,41.91 17.7,41.91 17.07,41.27 17.07,41.17 13.73,41.17 13.36,40.8 8.18,40.8 7.06,41.91 Q1.2 | 23.7,41.2 23.7,40.17 22.04,38.51 14.51,38.51 C13.1
XTO
  Top 0.15: 11.4,38.1 11.4,38.18 | 22.5,41.4 U$3.22 | 11.4,38.1 11.4,33.15 C14.1 | 11.4,38.1 C13.2
  Top 0.305: C14.1 11.3,38.08 11.4,38.18 | 22.5,41.4 18.18,41.4 17.5,40.72 13.92,40.72 C13.2

### Text on the board
tDocu: Moolet MODULAR / ADAT / v1.0
bDocu: nicnewdigate@gmail.com